# EAGLE design mirsot_sch-final (EAGLE 9.6.2)
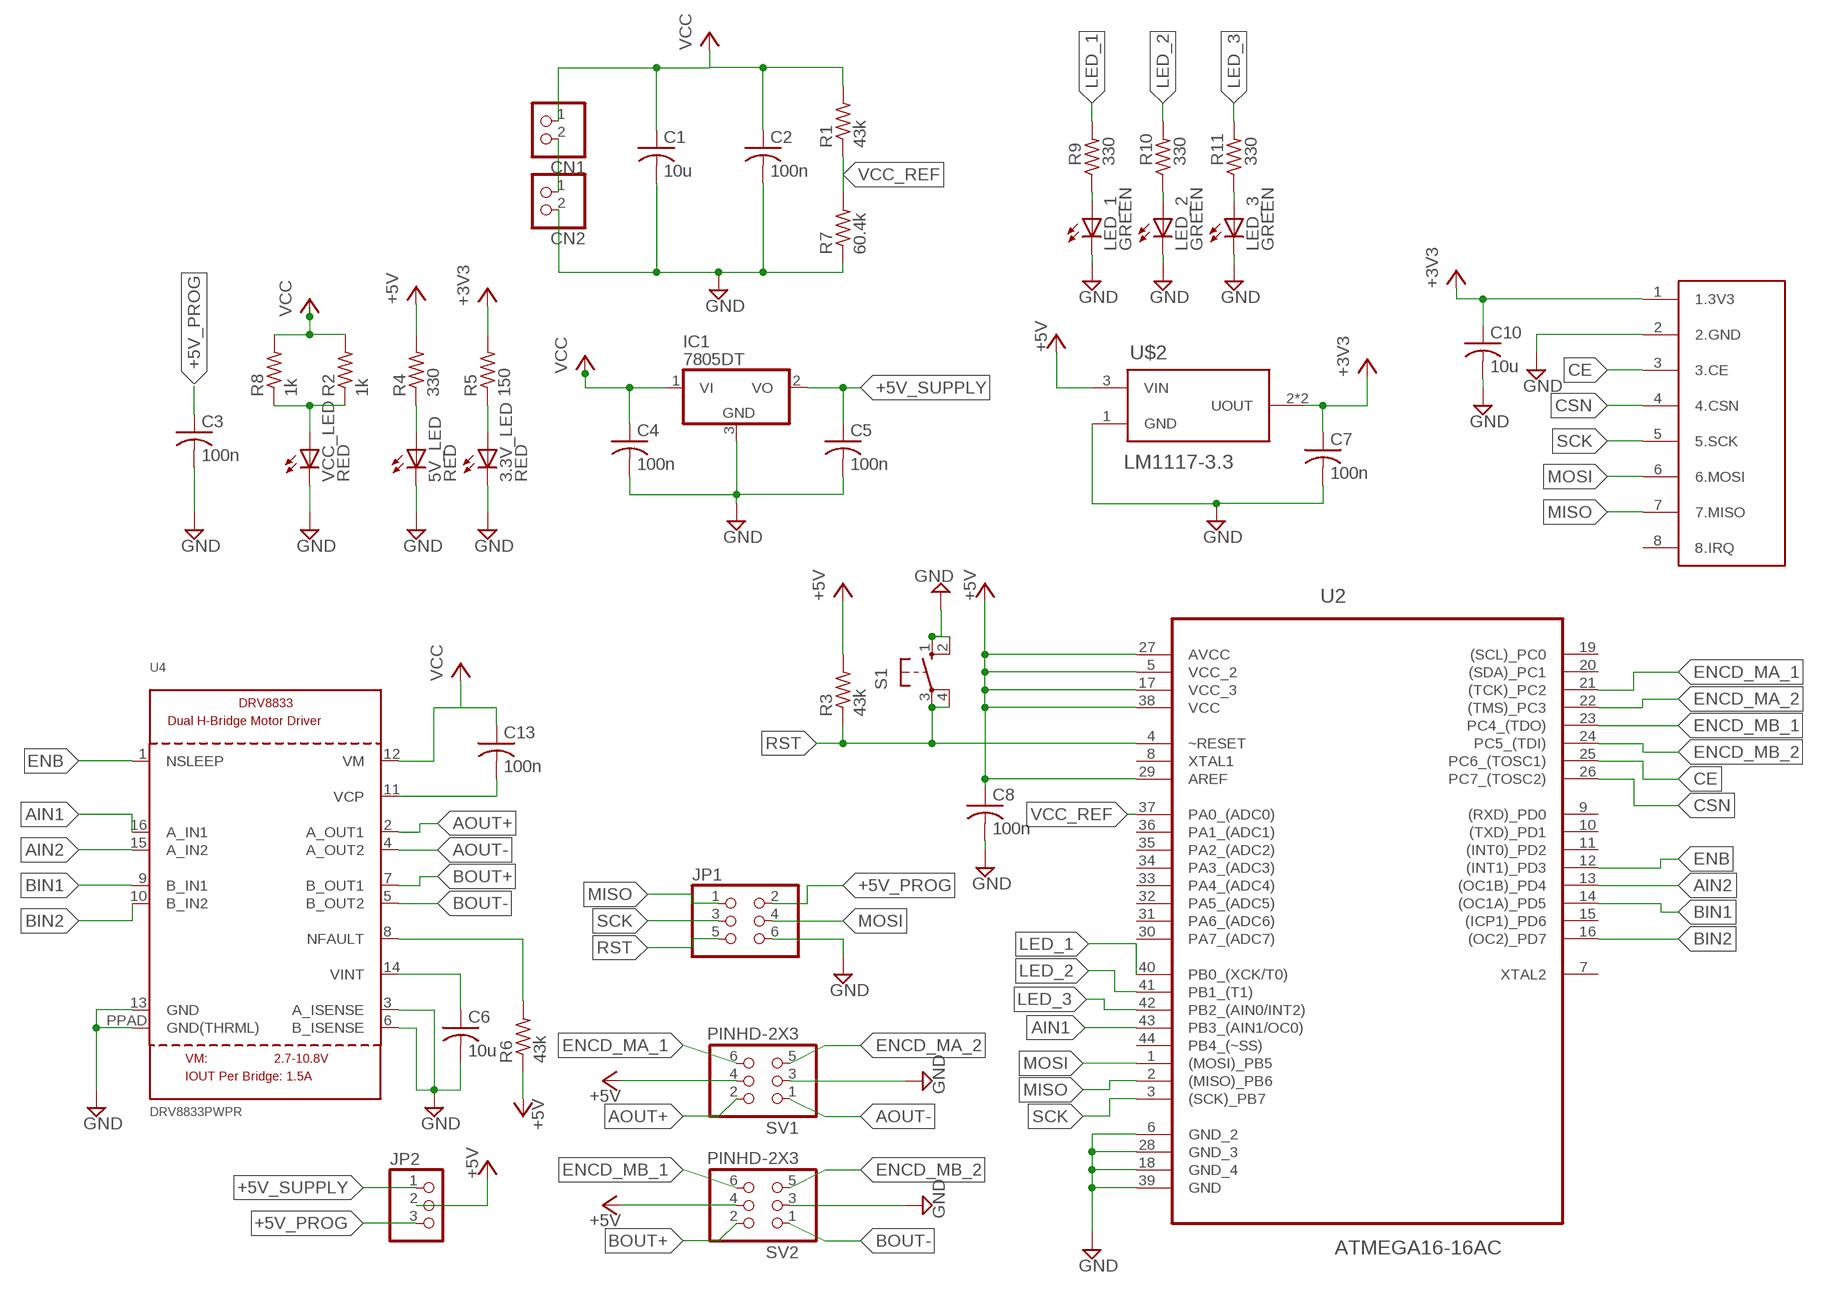
[diagram p0: schematic, sheet 1]

## Parts
3.3V_LED  RED  LEDCHIPLED_0603  [CHIPLED_0603]
5V_LED  RED  LEDCHIPLED_0603  [CHIPLED_0603]
C1  10u  C-USC0603  [C0603]
C2  100n  C-USC0603  [C0603]
C3  100n  C-USC0603  [C0603]
C4  100n  C-USC0603  [C0603]
C5  100n  C-USC0603  [C0603]
C6  10u  C-USC0603  [C0603]
C7  100n  C-USC0603  [C0603]
C8  100n  C-USC0603  [C0603]
C10  10u  C-USC0603  [C0603]
C13  100n  C-USC0603  [C0603]
CN1  JST_2PIN-THM  [JST-PH-2-THM]
CN2  JST_2PIN-THM  [JST-PH-2-THM]
IC1  7805DT  [TO252]
JP1  PINHD-2X3  [2X03]
JP2  PINHD-1X3  [1X03]
LED_1  GREEN  LEDCHIPLED_0603  [CHIPLED_0603]
LED_2  GREEN  LEDCHIPLED_0603  [CHIPLED_0603]
LED_3  GREEN  LEDCHIPLED_0603  [CHIPLED_0603]
R1  43k  R-US_R1206  [R1206]
R2  1k  R-US_R1206  [R1206]
R3  43k  R-US_R1206  [R1206]
R4  330  R-US_R1206  [R1206]
R5  150  R-US_R2512  [R2512]
R6  43k  R-US_R1206  [R1206]
R7  60.4k  R-US_R1206  [R1206]
R8  1k  R-US_R1206  [R1206]
R9  330  R-US_R1206  [R1206]
R10  330  R-US_R1206  [R1206]
R11  330  R-US_R1206  [R1206]
S1  10-XX  [B3F-10XX]
SV1  PINHD-2X3  [2X03]
SV2  PINHD-2X3  [2X03]
U2  ATMEGA16-16AC  [QFP80P1200X1200X120-44N]
U4  DRV8833PWPR  DRV8833  [HTSSOP16]
U$1  NRF24L01+  [NRF24L01+]
U$2  LM1117-3.3  [SOT-223]
VCC_LED  RED  LEDCHIPLED_0603  [CHIPLED_0603]

## Nets
+3V3: C7.1 C10.1 R5.2 U$1.1(1.3V3) U$2.2(UOUT) U$2.4(UOUT)
+5V: C8.1 JP2.2 R3.2 R4.2 R6.1 SV1.4 SV2.4 U2.5(VCC_2) U2.17(VCC_3) U2.27(AVCC) U2.29(AREF) U2.38(VCC) U$2.3(VIN)
+5V_PROG: C3.1 JP1.2 JP2.3
+5V_SUPPLY: C5.1 IC1.2(VO) JP2.1
AIN1: U2.43(PB3_(AIN1/OC0)) U4.16(A_IN1)
AIN2: U2.13((OC1B)_PD4) U4.15(A_IN2)
AOUT+: SV1.2 U4.2(A_OUT1)
AOUT-: SV1.1 U4.4(A_OUT2)
BIN1: U2.14((OC1A)_PD5) U4.9(B_IN1)
BIN2: U2.16((OC2)_PD7) U4.10(B_IN2)
BOUT+: SV2.2 U4.7(B_OUT1)
BOUT-: SV2.1 U4.5(B_OUT2)
CE: U2.25(PC6_(TOSC1)) U$1.3(3.CE)
CSN: U2.26(PC7_(TOSC2)) U$1.4(4.CSN)
ENB: U2.12((INT1)_PD3) U4.1(NSLEEP)
ENCD_MA_1: SV1.6 U2.21((TCK)_PC2)
ENCD_MA_2: SV1.5 U2.22((TMS)_PC3)
ENCD_MB_1: SV2.6 U2.23(PC4_(TDO))
ENCD_MB_2: SV2.5 U2.24(PC5_(TDI))
GND: 3.3V_LED.C 5V_LED.C C1.2 C2.2 C3.2 C4.2 C5.2 C6.2 C7.2 C8.2 C10.2 CN2.2 IC1.3(GND) JP1.6 LED_1.C LED_2.C LED_3.C R7.1 S1.1(S) S1.2(S1) SV1.3 SV2.3 U2.6(GND_2) U2.18(GND_4) U2.28(GND_3) U2.39(GND) U4.3(A_ISENSE) U4.6(B_ISENSE) U4.13(GND) U4.PPAD(GND(THRML)) U$1.2(2.GND) U$2.1(GND) VCC_LED.C
LED_1: R9.2 U2.40(PB0_(XCK/T0))
LED_2: R10.2 U2.41(PB1_(T1))
LED_3: R11.2 U2.42(PB2_(AIN0/INT2))
MISO: JP1.1 U2.2((MISO)_PB6) U$1.7(7.MISO)
MOSI: JP1.4 U2.1((MOSI)_PB5) U$1.6(6.MOSI)
N$1: CN1.2 CN2.1
N$2: R2.1 R8.1 VCC_LED.A
N$3: LED_1.A R9.1
N$4: LED_2.A R10.1
N$5: 5V_LED.A R4.1
N$6: 3.3V_LED.A R5.1
N$7: C13.2 U4.11(VCP)
N$8: C6.1 U4.14(VINT)
N$9: LED_3.A R11.1
NFAULT: R6.2 U4.8(NFAULT)
RST: JP1.5 R3.1 S1.3(P) S1.4(P1) U2.4(~RESET)
SCK: JP1.3 U2.3((SCK)_PB7) U$1.5(5.SCK)
VCC: C1.1 C2.1 C4.1 C13.1 CN1.1 IC1.1(VI) R1.2 R2.2 R8.2 U4.12(VM)
VCC_REF: R1.1 R7.2 U2.37(PA0_(ADC0))
Unconnected: U2.7(XTAL2) U2.8(XTAL1) U2.9((RXD)_PD0) U2.10((TXD)_PD1) U2.11((INT0)_PD2) U2.15((ICP1)_PD6) U2.19((SCL)_PC0) U2.20((SDA)_PC1) U2.30(PA7_(ADC7)) U2.31(PA6_(ADC6)) U2.32(PA5_(ADC5)) U2.33(PA4_(ADC4)) U2.34(PA3_(ADC3)) U2.35(PA2_(ADC2)) U2.36(PA1_(ADC1)) U2.44(PB4_(~SS)) U$1.8(8.IRQ)

## Library data of the parts
3.3V_LED 5V_LED LED_1-LED_3 VCC_LED = adafruit:LED: LED OSRAM: - CHIPLED LG R971, LG N971, LY N971, LG Q971, LY Q971, LO R971, LY R971 LH N974, LH R974 LS Q976, LO Q976, LY Q976 LO Q996 - Hyper CHIPLED LW Q18S LB Q993, LB Q99A, LB R99A - SideLED LS A670, LO A670, LY A670, LG A670, LP A670 LB A673, LV A673, LT A673, LW A673 LH A674 LY A675 LS A676, LA A676, LO A676, LY A676, LW A676 LS A679, LY A679, LG A679 - Hyper Micro SIDELED® LS Y876, LA Y876, LO Y876, LY Y876 LT Y87S - SmartLED LW L88C, LW L88S LB L89C, LB L89S, LG L890 LS L89K, LO L89K, LY L89K LS L896, LA L896, LO L896, LY L896 - TOPLED LS T670, LO T670, LY T670, LG T670, LP T670 LSG T670, LSP T670, LSY T670, LOP T670, LYG T670 LG T671, LOG T671, LSG T671 LB T673, LV T673, LT T673, LW T673 LH T674 LS T676, LA T676, LO T676, LY T676, LB T676, LH T676, LSB T676, LW T676 LB T67C, LV T67C, LT T67C, LS T67K, LO T67K, LY T67K, LW E67C LS E67B, LA E67B, LO E67B, LY E67B, LB E67C, LV E67C, LT E67C LW T67C LS T679, LY T679, LG T679 LS T770, LO T770, LY T770, LG T770, LP T770 LB T773, LV T773, LT T773, LW T773 LH T774 LS E675, LA E675, LY E675, LS T675 LS T776, LA T776, LO T776, LY T776, LB T776 LHGB T686 LT T68C, LB T68C - Hyper Mini TOPLED® LB M676 - Mini TOPLED Santana® LG M470 LS M47K, LO M47K, LY M47K Source: http://www.osram.convergy.de/
C1-C8 C10 C13 = rcl:C-US: CAPACITOR, American symbol; SPICEPREFIX: C
CN1 CN2 = adafruit:JST_2PIN: JST 2-Pin Connectors of various flavors SMT-RA (S2B-PH-SM4) 4UConnector #17311 SMT (B2B-PH-SM4) THM-RA (S2B-PH) THM (B2B-PH)
IC1 = linear:78*: Positive VOLTAGE REGULATOR Source: http://cache.national.com/ds/LM/LM78L05.pdf http://www.fairchildsemi.com/ds/LM/LM7805.pdf
JP1 = pinhead:PINHD-2X3: PIN HEADER
JP2 = pinhead:PINHD-1X3: PIN HEADER
R1-R11 = rcl:R-US_: RESISTOR, American symbol; SPICEPREFIX: R
S1 = switch-omron:10-XX: OMRON SWITCH; MPN: B3F-1000; OC_FARNELL: 176432; OC_NEWARK: 36M3542
SV1 SV2 = Connector:PINHD-2X3: PIN HEADER; CATEGORY: CONNECTOR; SUB-CATEGORY: PIN-HEADER
U2 = ATMEGA16-16AC:ATMEGA16-16AC: 8-bit Microcontroller Check availability <https://pricing.snapeda.com/parts/ATMEGA16-16AC/Microchip/view-part?ref=eda>; AVAILABILITY: In Stock; DESCRIPTION: AVR AVR® ATmega Microcontroller IC 8-Bit 16MHz 16KB (8K x 16) FLASH 44-TQFP (10x10); MF: Microchip; MP: ATMEGA16-16AC; PACKAGE: TQFP-44 Atmel; PRICE: None; PURCHASE-URL: https://pricing.snapeda.com/search/part/ATMEGA16-16AC/?ref=eda
U4 = microbuilder:DRV8833: DRV8833 Dual H-Bridge Motor Driver -- HTSSOP Package
U$1 = nrf:NRF24L01+
U$2 = LM1117-3.3:LM1117-3.3: Check availability <https://pricing.snapeda.com/parts/LM1117-3.3/Texas%20Instruments/view-part?ref=eda>; AVAILABILITY: Not in stock; DESCRIPTION: Linear Voltage Regulator IC Positive Fixed 1 Output 800mA DDPAK/TO-263-3; MF: Texas Instruments; MP: LM1117-3.3; PACKAGE: None; PRICE: None

## Board
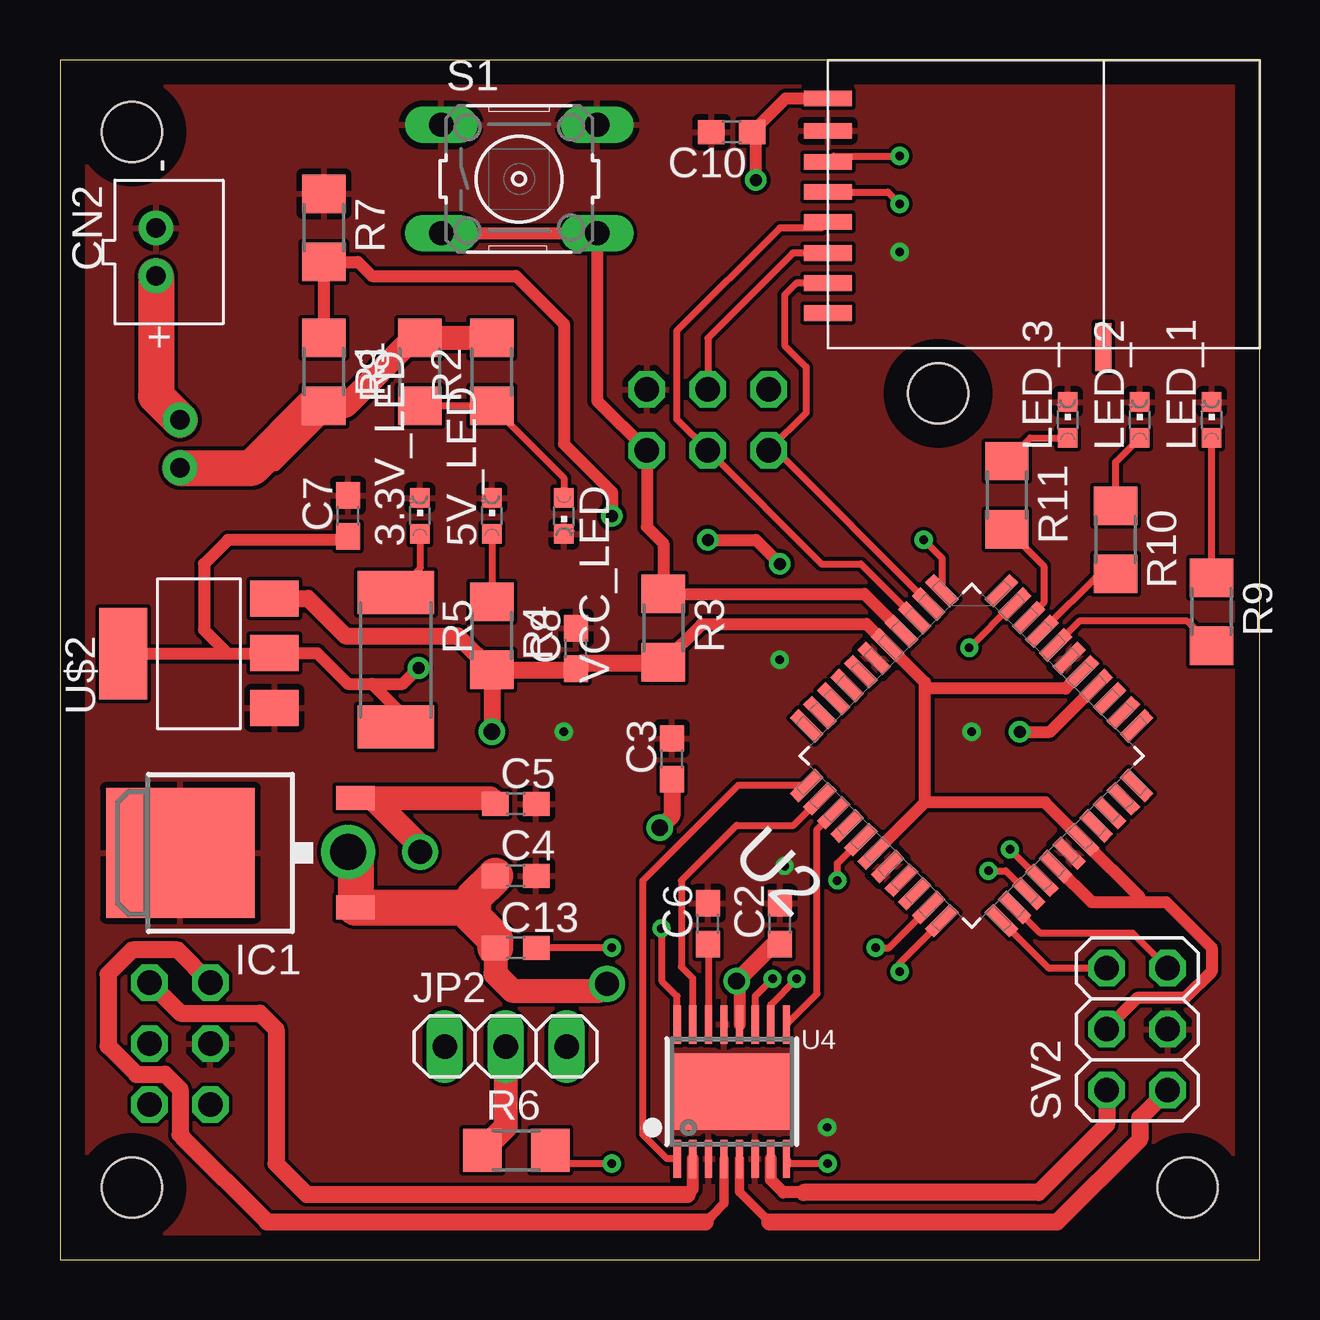
[diagram p1: board, top side]
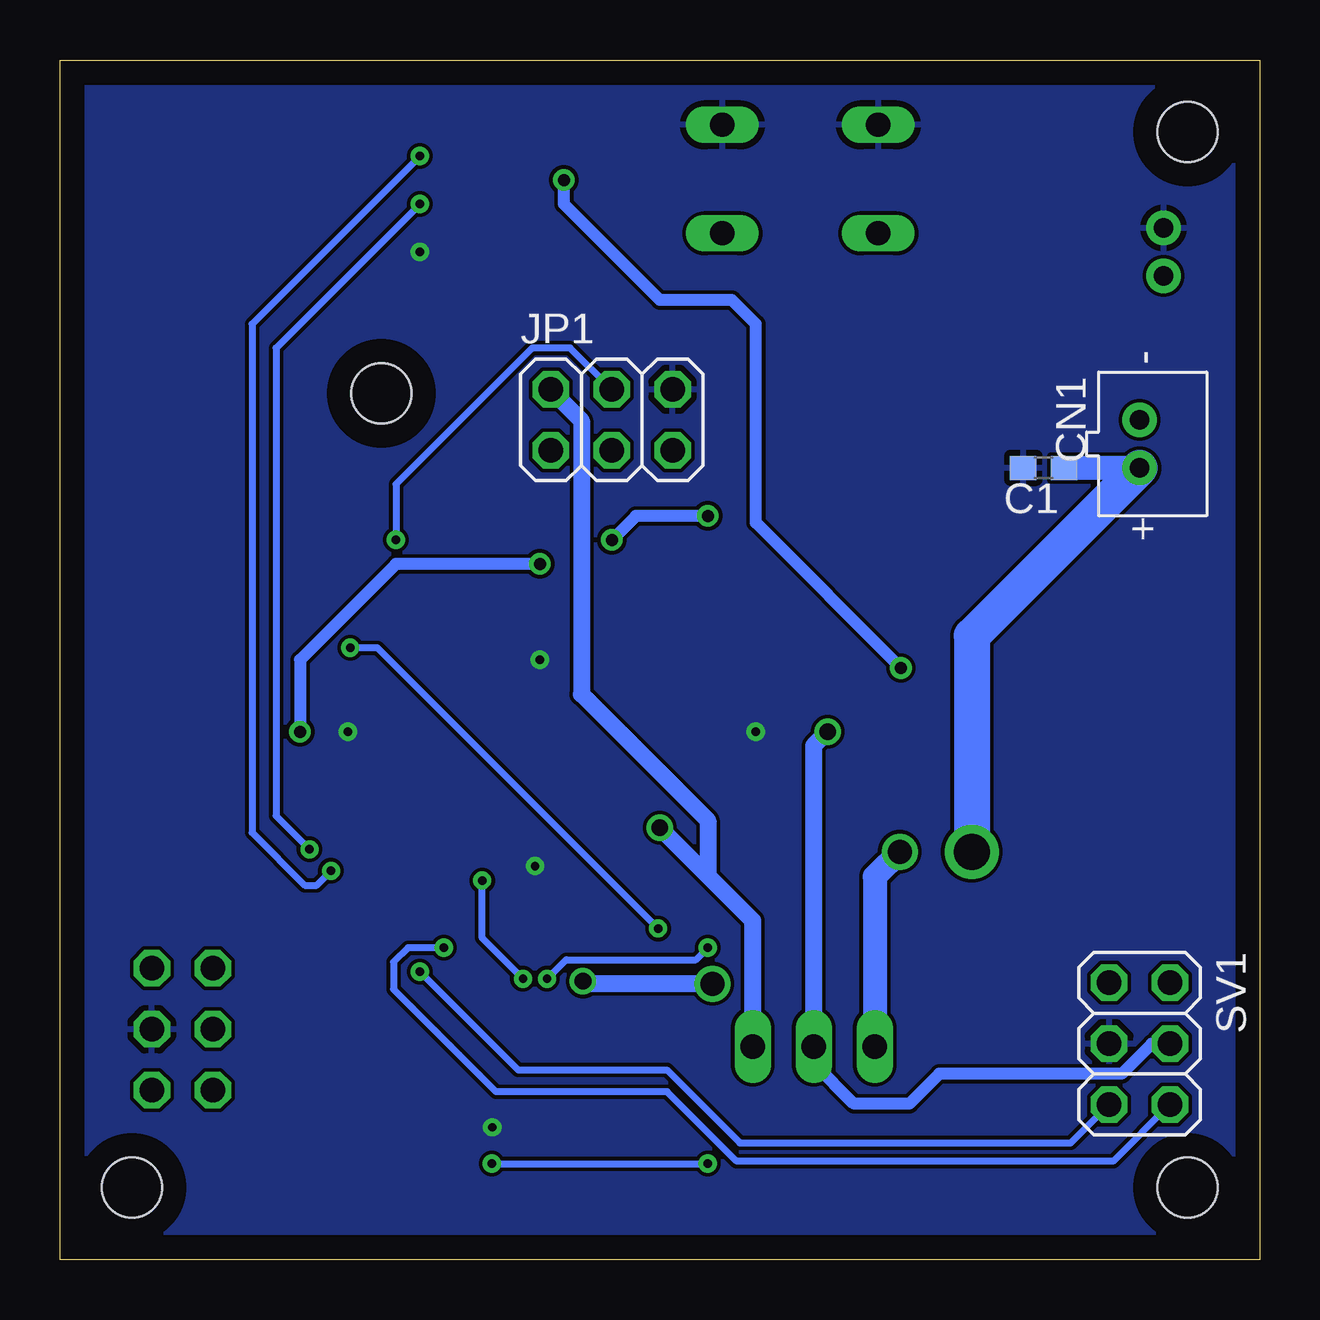
[diagram p2: board, bottom side, seen from below]

Size 50 x 50 mm. Coordinates in mm from the lower left corner, seen from the top.
Outline: 0,0 50,0 50,50 0,50 0,0
Copper layers (1*16): Top 0.035mm / dielectric 1.5mm / Bottom 0.035mm
Design rules "default": minimum track width 6mil, minimum drill 0.35mm, track to track 6mil, track to pad 6mil, pad to pad 6mil, via to via 6mil, smd to smd 6mil, copper to edge 40mil, drill to drill 6mil, minimum pad ring 10mil, minimum via ring 8mil, stop-mask expansion 4mil, vias tented up to drill 0mil, thermal gap 10mil
Holes 2.5 mm at 3,3 47,3 3,47 36.6,36.1

### Footprints (pad centres in the part's own frame; a part is rotated, then mirrored left to right if it is on the bottom)
CHIPLED_0603 = smd 0.8 x 0.8: A 0,-0.75; C 0,0.75
C0603 = smd 1.1 x 1: 1 -0.85,0; 2 0.85,0
JST-PH-2-THM = drill 0.8 pad 1.422: 1 1,0; 2 -1,0
TO252 = smd 1 x 1.6: 1 -2.28,-4.8; 2 2.28,-4.8 | smd 5.4 x 6.2: 3 0,2.5
2X03 = drill 1.016 octagon: 1 -2.54,-1.27; 2 -2.54,1.27; 3 0,-1.27; 4 0,1.27; 5 2.54,-1.27; 6 2.54,1.27
1X03 = drill 1.016 long: 1 -2.54,0; 2 0,0; 3 2.54,0
R1206 = smd 1.6 x 1.803: 1 -1.422,0; 2 1.422,0
R2512 = smd 1.8 x 3.2: 1 -2.8,0; 2 2.8,0
B3F-10XX = drill 1.016 long: 1 -3.251,2.261; 2 3.251,2.261; 3 -3.251,-2.261; 4 3.251,-2.261
QFP80P1200X1200X120-44N = smd 1.473 x 0.508: 1 -5.74,3.988; 2 -5.74,3.2; 3 -5.74,2.388; 4 -5.74,1.6; 5 -5.74,0.787; 6 -5.74,0; 7 -5.74,-0.787; 8 -5.74,-1.6; 9 -5.74,-2.388; 10 -5.74,-3.2; 11 -5.74,-3.988; 23 5.74,-3.988; 24 5.74,-3.2; 25 5.74,-2.388; 26 5.74,-1.6; 27 5.74,-0.787; 28 5.74,0; 29 5.74,0.787; 30 5.74,1.6; 31 5.74,2.388; 32 5.74,3.2; 33 5.74,3.988 | smd 0.508 x 1.473: 12 -3.988,-5.74; 13 -3.2,-5.74; 14 -2.388,-5.74; 15 -1.6,-5.74; 16 -0.787,-5.74; 17 0,-5.74; 18 0.787,-5.74; 19 1.6,-5.74; 20 2.388,-5.74; 21 3.2,-5.74; 22 3.988,-5.74; 34 3.988,5.74; 35 3.2,5.74; 36 2.388,5.74; 37 1.6,5.74; 38 0.787,5.74; 39 0,5.74; 40 -0.787,5.74; 41 -1.6,5.74; 42 -2.388,5.74; 43 -3.2,5.74; 44 -3.988,5.74
HTSSOP16 = smd 0.3 x 1.6: 1 -2.275,-2.8; 2 -1.625,-2.8; 3 -0.975,-2.8; 4 -0.325,-2.8; 5 0.325,-2.8; 6 0.975,-2.8; 7 1.625,-2.8; 8 2.275,-2.8; 9 2.275,2.8; 10 1.625,2.8; 11 0.975,2.8; 12 0.325,2.8; 13 -0.325,2.8; 14 -0.975,2.8; 15 -1.625,2.8; 16 -2.275,2.8 | smd 4.8 x 3.2: PPAD 0,0
NRF24L01+ = smd 0.65 x 2: 1 1.6,0; 2 2.95,0; 3 4.25,0; 4 5.5,0; 5 6.75,0; 6 8.05,0; 7 9.3,0; 8 10.55,0 | smd 2 x 0.65: 9 11.96,11.49
SOT-223 = smd 1.499 x 2.007: 1 -2.261,-3.15; 2 0.025,-3.15; 3 2.311,-3.15 | smd 3.81 x 2.007: 4 0,3.15

### Placement (x,y rotation side)
3.3V_LED  15,31 0 top
5V_LED  18,31 0 top
C1  9,33 180 bottom
C2  30,14 90 top
C3  25.5,20.87 90 top
C4  19,16 0 top
C5  19,19 0 top
C6  27,14 90 top
C7  12,31 90 top
C8  21.5,25.47 90 top
C10  28,47 180 top
C13  19,13 0 top
CN1  5,34 270 bottom
CN2  4,42 270 top
IC1  7.52,16.95 90 top
JP1  27,35 0 bottom
JP2  18.58,8.88 0 top
LED_1  48,35 0 top
LED_2  45,35 0 top
LED_3  42,35 0 top
R1  11,37 270 top
R2  18,37 90 top
R3  25.15,26.32 270 top
R4  18,26 270 top
R5  14,25 270 top
R6  19.02,4.55 0 top
R7  11,43 270 top
R8  15,37 90 top
R9  48,27 270 top
R10  44,30 270 top
R11  39.47,31.86 270 top
S1  19.14,45.04 0 top
SV1  5,9 270 bottom
SV2  44.9,9.6 90 top
U2  38,21 315 top
U4  28,7 0 top
U$1  32,50 270 top
U$2  5.79,25.25 90 top
VCC_LED  21,31 180 top

### Tracks (layer width: path | path; a pad name or v marks a point on that pad's centre or on a via)
+3V3  (via drill 0.5, 0.5 pad 0.6)
  Top 0.3: 28.93,46.92 C10.1
  Top 0.5: 13,24 12,24 10.72,25.27 U$2.2 8.91,25.25 7,25.25 | 13,24 14,23 R5.2 | 13,24 14.29,24 v14.95,24.66 | v29,45 29,46.85 28.93,46.92 | U$1.1 30.25,48.4 C10.1 | C7.1 11.85,30 7,30 6,29 6,26.25 7,25.25 | 7,25.25 U$2.4
  Bottom 0.5: v14.95,24.66 21,30.71 21,39 22,40 25,40 29,44 v29,45
+5V  (via drill 0.7)
  Top 0.3: 21.46,24.58 C8.1 | 25.13,24.87 R3.2 | 36.06,24 36.06,24.06
  Top 0.5: U2.27 41.52,16.38 43,14.9 45,14.9 | 45,14.9 46.1,14.9 48,13 48,12 46.9,10.9 44.9,10.9 43.63,9.63 SV2.4 | 45,14.9 45,15.11 U2.29 41.06,19.06 36.06,19.06 | U2.17 36.06,19.06 | 36.06,19.06 36.06,23.8 | 36.06,23.8 36.06,24 | 36.06,24.06 U2.5 33.61,26.5 26.75,26.5 R3.2 | U2.38 41.91,23.8 36.06,23.8
  Top 0.7: R4.2 v18,22 | R4.2 21.46,24.58 | C8.1 21.75,24.87 25.13,24.87 | U$2.3 10.34,27.56 11.9,26 16.58,26 R4.2
  Top 1: JP2.2 18.58,5.53 R6.1
  Bottom 0.5: SV1.4 4.49,9 5.74,7.75 13.35,7.75 14.6,6.5 16.9,6.5 18.58,8.18 JP2.2
  Bottom 0.7: JP2.2 18.58,21.42 v18,22
+5V_PROG  (via drill 0.7)
  Top 0.7: C3.1 25.5,18.5 v25,18
  Bottom 0.7: JP2.3 21.12,14.12 23,16 | JP1.2 29.54,36.24 28.26,34.96 28.26,23.56 23,18.3 23,16 | v25,18 23,16
+5V_SUPPLY  (via drill 1)
  Top 0.3: IC1.2 12.77,19.23 v15,17
  Top 1: IC1.2 13,19.23 | 13,19.23 17.92,19.23 C5.1 | 13,19.23 15,17.23 v15,17
  Bottom 1: v15,17 16.04,15.96 JP2.1
AIN1  (via drill 0.35)
  Top 0.3: U4.16 25.73,10.97 25.1,11.6 25.1,13.8 v25.07,13.8 | v37.9,25.5 39.72,27.32 U2.43
  Bottom 0.3: v25.07,13.8 36.77,25.5 v37.9,25.5
AIN2
  Top 0.3: U4.15 26.38,11.72 25.9,12.2 25.9,15.8 28.2,18.1 30.57,18.1 U2.13
AOUT+
  Top 0.5: 26.14,2.7 26.38,2.93 U4.2
  Top 0.7: SV1.2 3.76,11.54 5.04,10.26 8.34,10.26 9,9.6 9,4 10.3,2.7 26.14,2.7
AOUT-
  Top 0.3: 5,5.2 5.1,5.1
  Top 0.4: 26.9,1.57 27.17,1.83 27.68,2.34 U4.4
  Top 0.7: SV1.1 4.91,12.9 3,12.9 2,11.9 2,8.9 3.19,7.71 3.21,7.72 4.38,7.72 5,7.1 5,5.2 | 5.1,5.1 8.63,1.57 26.9,1.57
BIN1
  Top 0.3: U4.9 31.56,11.08 31.56,17.93 U2.14
BIN2  (via drill 0.35)
  Top 0.3: U4.10 29.62,10.62 v30.7,11.7 | v32.4,15.8 32.4,16.51 U2.16
  Bottom 0.3: v30.7,11.7 32.4,13.4 v32.4,15.8
BOUT+
  Top 0.5: 31,2.8 30.16,2.8 29.62,3.33 U4.7
  Top 0.7: SV2.2 43.63,5.63 40.8,2.8 31,2.8
BOUT-
  Top 0.4: U4.5 28.32,2.81 29.57,1.57
  Top 0.7: SV2.1 45,5.89 45,5 41.57,1.57 29.57,1.57
CE  (via drill 0.35)
  Top 0.3: v38.7,16.2 39.42,16.2 U2.25 | U$1.3 32.25,46 v35,46
  Bottom 0.3: v35,46 42,39 42,17.8 39.8,15.6 39.3,15.6 v38.7,16.2
CSN  (via drill 0.35)
  Top 0.3: U2.26 40.89,15.81 v39.6,17.1 | U$1.4 34.5,44.5 v35,44
  Bottom 0.3: v35,44 41,38 41,18.5 v39.6,17.1
ENB
  Top 0.3: U4.1 25.3,4.2 24.3,5.2 24.3,15.8 28.26,19.76 U2.12
ENCD_MA_1  (via drill 0.35)
  Top 0.3: U2.21 36.2,14.64 34.56,13 v34,13
  Bottom 0.3: v34,13 35.5,13 36.1,12.4 36.1,11.27 31.83,7 24.7,7 21.8,4.09 6.09,4.09 SV1.6
ENCD_MA_2  (via drill 0.35)
  Top 0.3: v35,12 35,12.36 U2.22
  Bottom 0.3: SV1.5 7.87,4.86 21.66,4.86 24.7,7.9 30.9,7.9 v35,12
ENCD_MB_1
  Top 0.3: SV2.6 41.22,12.14 U2.23
ENCD_MB_2
  Top 0.3: SV2.5 44.71,13.6 40.87,13.6 U2.24
GND  (via drill 0.35)
  other vias: 30.2,16.4 30,25 35,42 21,22 38,22 31.98,5.51
  pour Top: -1,50 -1,-1 51,-1 51,51 -1,51
  pour Bottom: -1,51 -1,-1 51,-1 51,51
LED_1
  Top 0.3: U2.40 42.5,26.61 46.99,26.61 48,25.6 R9.2
LED_2
  Top 0.3: R10.2 43.31,28.58 U2.41
LED_3
  Top 0.3: R11.2 41,28.91 41,27.38 U2.42
MISO
  Top 0.3: U$1.7 30.7,40.7 30.2,40.2 30.2,38.1 31.1,37.2 31.1,35.29 JP1.1 29.84,33.73 36.2,27.37 U2.2
MOSI  (via drill 0.35)
  Top 0.3: JP1.4 27,38.4 30.55,41.95 U$1.6 | v36,30 36.76,29.24 U2.1
  Bottom 0.3: JP1.4 28.73,38 30.32,38 36,32.32 v36,30
N$1
  Top 1.5: CN2.1 4,36 CN1.2
N$2
  Top 0.3: R8.1 R2.1 21,32.58 VCC_LED.A
N$3
  Top 0.3: R9.1 LED_1.A
N$4
  Top 0.3: R10.1 44,33.25 LED_2.A
N$5
  Top 0.3: 5V_LED.A R4.1
N$6
  Top 0.3: 3.3V_LED.A 15,28.8 R5.1
N$7  (via drill 0.35)
  Top 0.3: v23,13 C13.2 | U4.11 28.98,10.97 v29.7,11.7
  Bottom 0.3: v29.7,11.7 28.9,12.5 23.5,12.5 v23,13
N$8
  Top 0.3: C6.1 27.02,13.12 U4.14
N$9
  Top 0.3: R11.1 40.44,34.25 LED_3.A
NFAULT  (via drill 0.35)
  Top 0.3: R6.2 20.99,4 v23,4 | v32,4 30.48,4 U4.8
  Bottom 0.3: v32,4 v23,4
RST
  Top 0.5: S1.3 S1.4 22.39,35.8 JP1.5 24.46,30.54 25.15,29.85 R3.1 33.52,27.74 U2.4
SCK
  Top 0.3: U$1.5 31.75,43 30,43 25.7,38.7 25.7,35.03 JP1.3 31.73,29 33.38,29 U2.3
VCC  (via drill 0.7, 1, 1.5)
  Top 0.3: 8,33 9,33 11,35 R1.2 | C4.1 16.82,14.67 17.25,14.24 18.15,13.34
  Top 0.5: v28.2,11.6 28.32,11.47 U4.12
  Top 0.7: v28.2,11.6 29.75,13.15 C2.1
  Top 1: R1.2 11.9,35.58 14.74,38.42 R8.2 R2.2 | C13.1 18.15,11.91 18.86,11.2 22.5,11.2 v22.8,11.5
  Top 1.5: CN1.1 8,33 10.58,35.58 R1.2 | v12,17 12.32,16.68 IC1.1 16.82,14.67 18.15,13.34 C13.1 | 17.25,14.24 17.25,15.1 C4.1
  Bottom 0.3: 8,33 C1.1
  Bottom 0.7: v22.8,11.5 28.1,11.5 v28.2,11.6
  Bottom 1: CN1.1 8,33
  Bottom 1.5: CN1.1 12,26 v12,17
VCC_REF  (via drill 0.5)
  Top 0.3: 43.13,23.87 U2.37
  Top 0.5: R1.1 R7.2 12.42,41.58 13,41 19,41 21,39 21,34 23,32 v23,31 | v27,30 29,30 v30,29 | v40,22 41.26,22 43.13,23.87
  Bottom 0.5: v23,31 26,31 v27,30 | v30,29 36,29 40,25 v40,22